# EAGLE schematic covid-respirator-ProtoB (EAGLE 7.3.0)
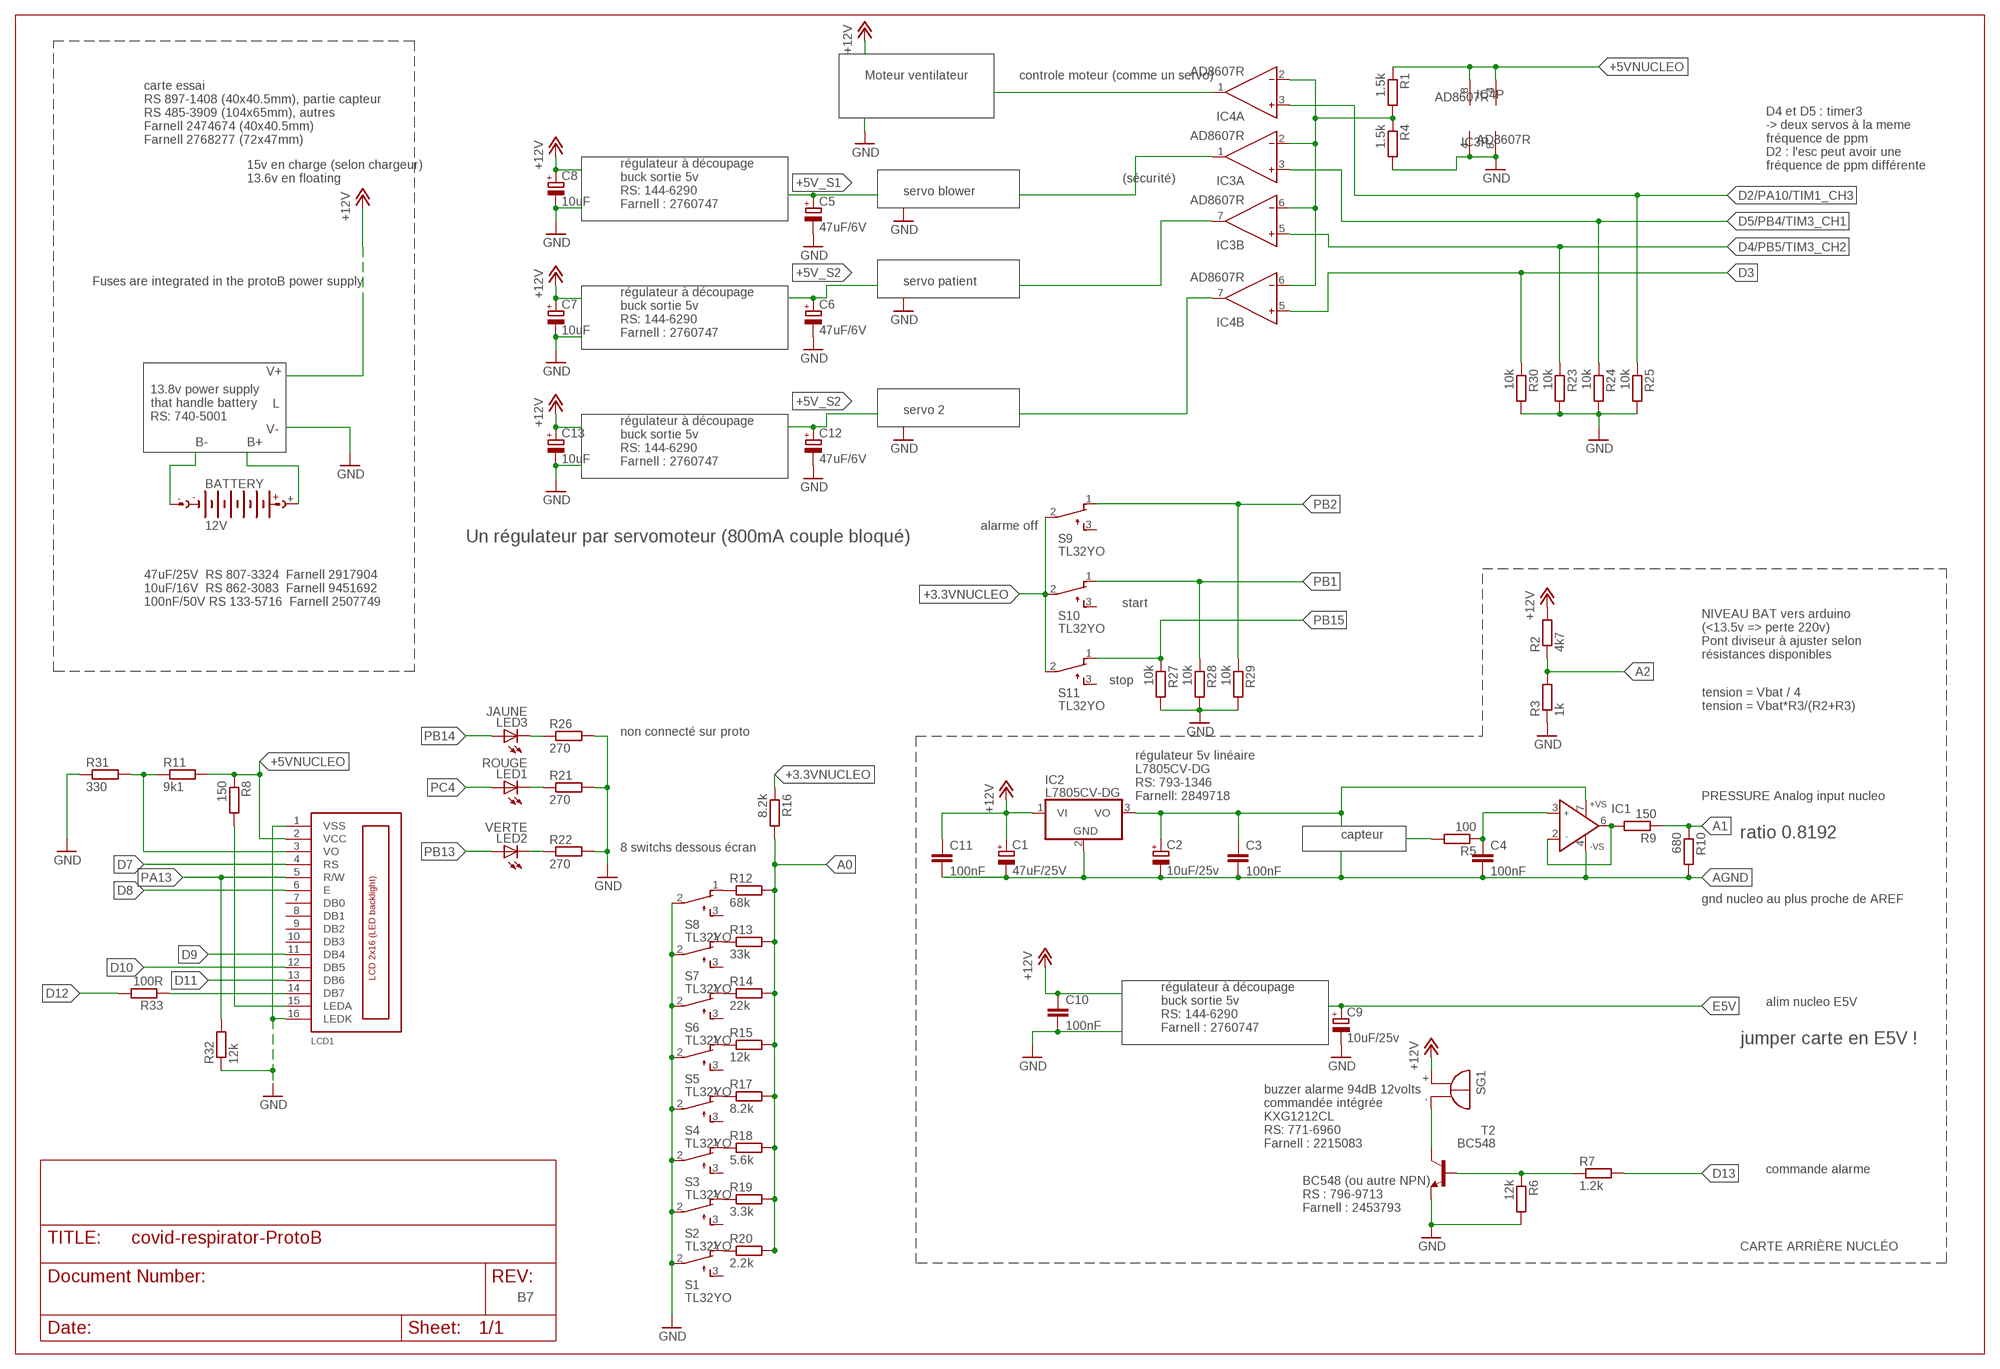
[diagram p0: schematic, sheet 1]

## Parts
BATTERY  12V  AB9V  [AB9V]
C1  47uF/25V  CPOL-EU150CLZ-1010  [150CLZ-1010]
C2  10uF/25v  CPOL-EU150CLZ-1010  [150CLZ-1010]
C3  100nF  C-EU050-050X075  [C050-050X075]
C4  100nF  C-EU050-050X075  [C050-050X075]
C5  47uF/6V  CPOL-EU150CLZ-1010  [150CLZ-1010]
C6  47uF/6V  CPOL-EU150CLZ-1010  [150CLZ-1010]
C7  10uF  CPOL-EU150CLZ-1010  [150CLZ-1010]
C8  10uF  CPOL-EU150CLZ-1010  [150CLZ-1010]
C9  10uF/25v  CPOL-EU150CLZ-1010  [150CLZ-1010]
C10  100nF  C-EU050-050X075  [C050-050X075]
C11  100nF  C-EU050-050X075  [C050-050X075]
C12  47uF/6V  CPOL-EU150CLZ-1010  [150CLZ-1010]
C13  10uF  CPOL-EU150CLZ-1010  [150CLZ-1010]
IC1  AD825R  [SO8]
IC2  L7805CV-DG  7805T  [TO220H]
IC3  AD8607R  [SO8]
IC4  AD8607R  [SO8]
LCD1  LCD_2X16_SIL  [HY-1602F]
LED1  ROUGE  LED3MM  [LED3MM]
LED2  VERTE  LED3MM  [LED3MM]
LED3  JAUNE  LED3MM  [LED3MM]
R1  1.5k  R-EU_0207/10  [0207/10]
R2  4k7  R-EU_0207/10  [0207/10]
R3  1k  R-EU_0207/10  [0207/10]
R4  1.5k  R-EU_0207/10  [0207/10]
R5  100  R-EU_0207/10  [0207/10]
R6  12k  R-EU_0207/10  [0207/10]
R7  1.2k  R-EU_0207/10  [0207/10]
R8  150  R-EU_0207/10  [0207/10]
R9  150  R-EU_0207/10  [0207/10]
R10  680  R-EU_0207/10  [0207/10]
R11  9k1  R-EU_0207/10  [0207/10]
R12  68k  R-EU_0207/10  [0207/10]
R13  33k  R-EU_0207/10  [0207/10]
R14  22k  R-EU_0207/10  [0207/10]
R15  12k  R-EU_0207/10  [0207/10]
R16  8.2k  R-EU_0207/10  [0207/10]
R17  8.2k  R-EU_0207/10  [0207/10]
R18  5.6k  R-EU_0207/10  [0207/10]
R19  3.3k  R-EU_0207/10  [0207/10]
R20  2.2k  R-EU_0207/10  [0207/10]
R21  270  R-EU_0207/10  [0207/10]
R22  270  R-EU_0207/10  [0207/10]
R23  10k  R-EU_0207/10  [0207/10]
R24  10k  R-EU_0207/10  [0207/10]
R25  10k  R-EU_0207/10  [0207/10]
R26  270  R-EU_0207/10  [0207/10]
R27  10k  R-EU_0207/10  [0207/10]
R28  10k  R-EU_0207/10  [0207/10]
R29  10k  R-EU_0207/10  [0207/10]
R30  10k  R-EU_0207/10  [0207/10]
R31  330  R-EU_0207/10  [0207/10]
R32  12k  R-EU_0207/10  [0207/10]
R33  100R  R-EU_0207/10  [0207/10]
S1  TL32YO  [TL3XYO]
S2  TL32YO  [TL3XYO]
S3  TL32YO  [TL3XYO]
S4  TL32YO  [TL3XYO]
S5  TL32YO  [TL3XYO]
S6  TL32YO  [TL3XYO]
S7  TL32YO  [TL3XYO]
S8  TL32YO  [TL3XYO]
S9  TL32YO  [TL3XYO]
S10  TL32YO  [TL3XYO]
S11  TL32YO  [TL3XYO]
SG1  F/EB20P  [F/EB20P]
T2  BC548  BC548-NPN-TO92-CBE  [TO92-CBE]

## Nets
6546876: C4.1 IC1.3(IN+) R5.1
+3.3VNUCLEO: R16.1 S9.2(P) S10.2(P) S11.2(P)
+5V_S1: C5.+
+5V_S2: C6.+ C12.+
+5VNUCLEO: IC3.4(P:V-) IC4.8(P:V+) LCD1.2(VCC) R1.1 R8.1 R11.2
+12V: C1.+ C7.+ C8.+ C10.1 C11.1 C13.+ IC2.1(VI) R2.2 SG1.+
A0: R12.2 R13.2 R14.2 R15.2 R16.2 R17.2 R18.2 R19.2 R20.2
A1: R9.1 R10.1
A2: R2.1 R3.2
AGND: C1.- C2.- C3.2 C4.2 C11.2 IC1.4(-VS) IC2.2(GND) R10.2
AREF: C2.+ C3.1 IC1.7(+VS) IC2.3(VO)
D2/PA10/TIM1_CH3: IC4.3(A:IN+) R25.1
D3: IC4.5(B:IN+) R30.1
D4/PB5/TIM3_CH2: IC3.5(B:IN+) R23.1
D5/PB4/TIM3_CH1: IC3.3(A:IN+) R24.1
D7: LCD1.4(RS)
D8: LCD1.6(E)
D9: LCD1.11(DB4)
D10: LCD1.12(DB5)
D11: LCD1.13(DB6)
D12: R33.2
D13: R7.2
E5V: C9.+
GND: C5.- C6.- C7.- C8.- C9.- C10.2 C12.- C13.- IC3.8(P:V+) IC4.4(P:V-) LCD1.1(VSS) LCD1.16(LEDK) R3.1 R4.2 R6.2 R21.2 R22.2 R23.2 R24.2 R25.2 R26.2 R27.2 R28.2 R29.2 R30.2 R31.1 R32.1 S1.2(P) S2.2(P) S3.2(P) S4.2(P) S5.2(P) S6.2(P) S7.2(P) S8.2(P) T2.E
N$1: IC4.1(A:OUT)
N$2: BATTERY.-
N$3: BATTERY.+
N$4: IC3.2(A:IN-) IC3.6(B:IN-) IC4.2(A:IN-) IC4.6(B:IN-) R1.2 R4.1
N$5: IC3.1(A:OUT)
N$6: IC3.7(B:OUT)
N$7: LCD1.15(LEDA) R8.2
N$8: IC1.2(IN-) IC1.6(OUT) R9.2
N$9: R5.2
N$10: LCD1.3(VO) R11.1 R31.2
N$11: R12.1 S8.1(O)
N$12: SG1.- T2.C
N$13: R6.1 R7.1 T2.B
N$14: R13.1 S7.1(O)
N$15: R14.1 S6.1(O)
N$16: R15.1 S5.1(O)
N$17: IC4.7(B:OUT)
N$18: R17.1 S4.1(O)
N$19: R18.1 S3.1(O)
N$20: R19.1 S2.1(O)
N$21: R20.1 S1.1(O)
N$22: LED3.K(C) R26.1
N$23: LED1.K(C) R21.1
N$24: LED2.K(C) R22.1
N$25: LCD1.14(DB7) R33.1
PA13: LCD1.5(R/W) R32.2
PB1: R28.1 S10.1(O)
PB2: R29.1 S9.1(O)
PB13: LED2.A
PB14: LED3.A
PB15: R27.1 S11.1(O)
PC4: LED1.A
Unconnected: LCD1.7(DB0) LCD1.8(DB1) LCD1.9(DB2) LCD1.10(DB3) S1.3(S) S2.3(S) S3.3(S) S4.3(S) S5.3(S) S6.3(S) S7.3(S) S8.3(S) S9.3(S) S10.3(S) S11.3(S)

## Notes on the sheet
- Moteur ventilateur | controle moteur (comme un servo)
- carte essai
  RS 897-1408 (40x40.5mm), partie capteur
  RS 485-3909 (104x65mm), autres
  Farnell 2474674 (40x40.5mm)
  Farnell 2768277 (72x47mm)
- D4 et D5 : timer3
  -> deux servos à la meme
  fréquence de ppm
  D2 : l'esc peut avoir une
  fréquence de ppm différente
- 15v en charge (selon chargeur)
  13.6v en floating
- (sécurité)
- servo blower
- régulateur à découpage
  buck sortie 5v
  RS: 144-6290
  Farnell : 2760747
- Fuses are integrated in the protoB power supply | servo patient
- régulateur à découpage
  buck sortie 5v
  RS: 144-6290
  Farnell : 2760747
- V+
- L
- servo 2
- 13.8v power supply
  that handle battery
  RS: 740-5001
- V-
- B- | B+
- régulateur à découpage
  buck sortie 5v
  RS: 144-6290
  Farnell : 2760747
- alarme off
- Un régulateur par servomoteur (800mA couple bloqué)
- start
- 47uF/25V  RS 807-3324  Farnell 2917904
  10uF/16V  RS 862-3083  Farnell 9451692
  100nF/50V RS 133-5716  Farnell 2507749
- NIVEAU BAT vers arduino
  (<13.5v => perte 220v)
  Pont diviseur à ajuster selon 
  résistances disponibles
- stop
- tension = Vbat / 4
  tension = Vbat*R3/(R2+R3)
- non connecté sur proto
- régulateur 5v linéaire
  L7805CV-DG
  RS: 793-1346
  Farnell: 2849718
- PRESSURE Analog input nucleo
- capteur | ratio 0.8192
- 8 switchs dessous écran
- gnd nucleo au plus proche de AREF
- alim nucleo E5V
- régulateur à découpage
  buck sortie 5v
  RS: 144-6290
  Farnell : 2760747
- jumper carte en E5V !
- buzzer alarme 94dB 12volts
  commandée intégrée
  KXG1212CL
  RS: 771-6960
  Farnell : 2215083
- commande alarme
- BC548 (ou autre NPN)
  RS : 796-9713
  Farnell : 2453793
- CARTE ARRIÈRE NUCLÉO
- B7

## Library data of the parts
BATTERY = battery:AB9V: 9-V BATTERY CLIP
C1 C2 C5-C9 C12 C13 = rcl:CPOL-EU: POLARIZED CAPACITOR, European symbol
C3 C4 C10 C11 = rcl:C-EU: CAPACITOR, European symbol
IC1 = analog-devices:AD825: Low Cost, General-Purpose High Speed JFET Amplifier Source: http://www.analog.com/static/imported-files/data_sheets/AD825.pdf; MF: ALTERA CORPORATION; MPN: AD825ARZ; OC_FARNELL: 9603735; OC_NEWARK: 59K6528
IC2 = linear:78*: Positive VOLTAGE REGULATOR Source: http://cache.national.com/ds/LM/LM78L05.pdf http://www.fairchildsemi.com/ds/LM/LM7805.pdf
IC3 IC4 = analog-devices:AD8607: Precision Micropower, Low Noise CMOS, Rail-to-Rail Input/Output Operational Amplifiers Source: http://www.analog.com/static/imported-files/data_sheets/AD8603_8607_8609.pdf; MPN: AD8607ARMZ-R2; OC_FARNELL: 1651293; OC_NEWARK: 19M8927
LCD1 = lcd_2x16_led_backlight:LCD_2X16_SIL
LED1-LED3 = led:LED: LED OSRAM: - CHIPLED LG R971, LG N971, LY N971, LG Q971, LY Q971, LO R971, LY R971 LH N974, LH R974 LS Q976, LO Q976, LY Q976 LO Q996 - Hyper CHIPLED LW Q18S LB Q993, LB Q99A, LB R99A - SideLED LS A670, LO A670, LY A670, LG A670, LP A670 LB A673, LV A673, LT A673, LW A673 LH A674 LY A675 LS A676, LA A676, LO A676, LY A676, LW A676 LS A679, LY A679, LG A679 - Hyper Micro SIDELED® LS Y876, LA Y876, LO Y876, LY Y876 LT Y87S - SmartLED LW L88C, LW L88S LB L89C, LB L89S, LG L890 LS L89K, LO L89K, LY L89K LS L896, LA L896, LO L896, LY L896 - TOPLED LS T670, LO T670, LY T670, LG T670, LP T670 LSG T670, LSP T670, LSY T670, LOP T670, LYG T670 LG T671, LOG T671, LSG T671 LB T673, LV T673, LT T673, LW T673 LH T674 LS T676, LA T676, LO T676, LY T676, LB T676, LH T676, LSB T676, LW T676 LB T67C, LV T67C, LT T67C, LS T67K, LO T67K, LY T67K, LW E67C LS E67B, LA E67B, LO E67B, LY E67B, LB E67C, LV E67C, LT E67C LW T67C LS T679, LY T679, LG T679 LS T770, LO T770, LY T770, LG T770, LP T770 LB T773, LV T773, LT T773, LW T773 LH T774 LS E675, LA E675, LY E675, LS T675 LS T776, LA T776, LO T776, LY T776, LB T776 LHGB T686 LT T68C, LB T68C - Hyper Mini TOPLED® LB M676 - Mini TOPLED Santana® LG M470 LS M47K, LO M47K, LY M47K Source: http://www.osram.convergy.de LUXEON: - LUMILED® LXK2-PW12-R00, LXK2-PW12-S00, LXK2-PW14-U00, LXK2-PW14-V00 LXK2-PM12-R00, LXK2-PM12-S00, LXK2-PM14-U00 LXK2-PE12-Q00, LXK2-PE12-R00, LXK2-PE12-S00, LXK2-PE14-T00, LXK2-PE14-U00 LXK2-PB12-K00, LXK2-PB12-L00, LXK2-PB12-M00, LXK2-PB14-N00, LXK2-PB14-P00, LXK2-PB14-Q00 LXK2-PR12-L00, LXK2-PR12-M00, LXK2-PR14-Q00, LXK2-PR14-R00 LXK2-PD12-Q00, LXK2-PD12-R00, LXK2-PD12-S00 LXK2-PH12-R00, LXK2-PH12-S00 LXK2-PL12-P00, LXK2-PL12-Q00, LXK2-PL12-R00 Source: www.luxeon.com KINGBRIGHT: KA-3528ASYC Source: www.kingbright.com
R1-R33 = rcl:R-EU_: RESISTOR, European symbol
S1-S11 = switch:TL32YO: TINY SWITCH ON - MOM Source: http://www2.produktinfo.conrad.com/datenblaetter/700000-724999/705152-da-01-de-Subminiaturschalter_TL_36YO.pdf
SG1 = buzzer:F/EB20P: BUZZER Source: Buerklin; OC_FARNELL: unknown; OC_NEWARK: unknown
T2 = transistor:*-NPN-: NPN Transistror BF959 corrected 2008.03.06